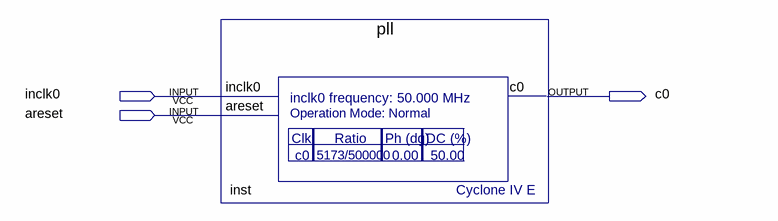
[diagram p0: schematic sheet]
// Quartus schematic atv01.bdf as structural Verilog: 1 symbols, 3 pins
module atv01 (
  input  inclk0,
  input  areset,
  output c0
);

  pll inst (.inclk0(inclk0), .areset(areset), .c0(c0));
endmodule
